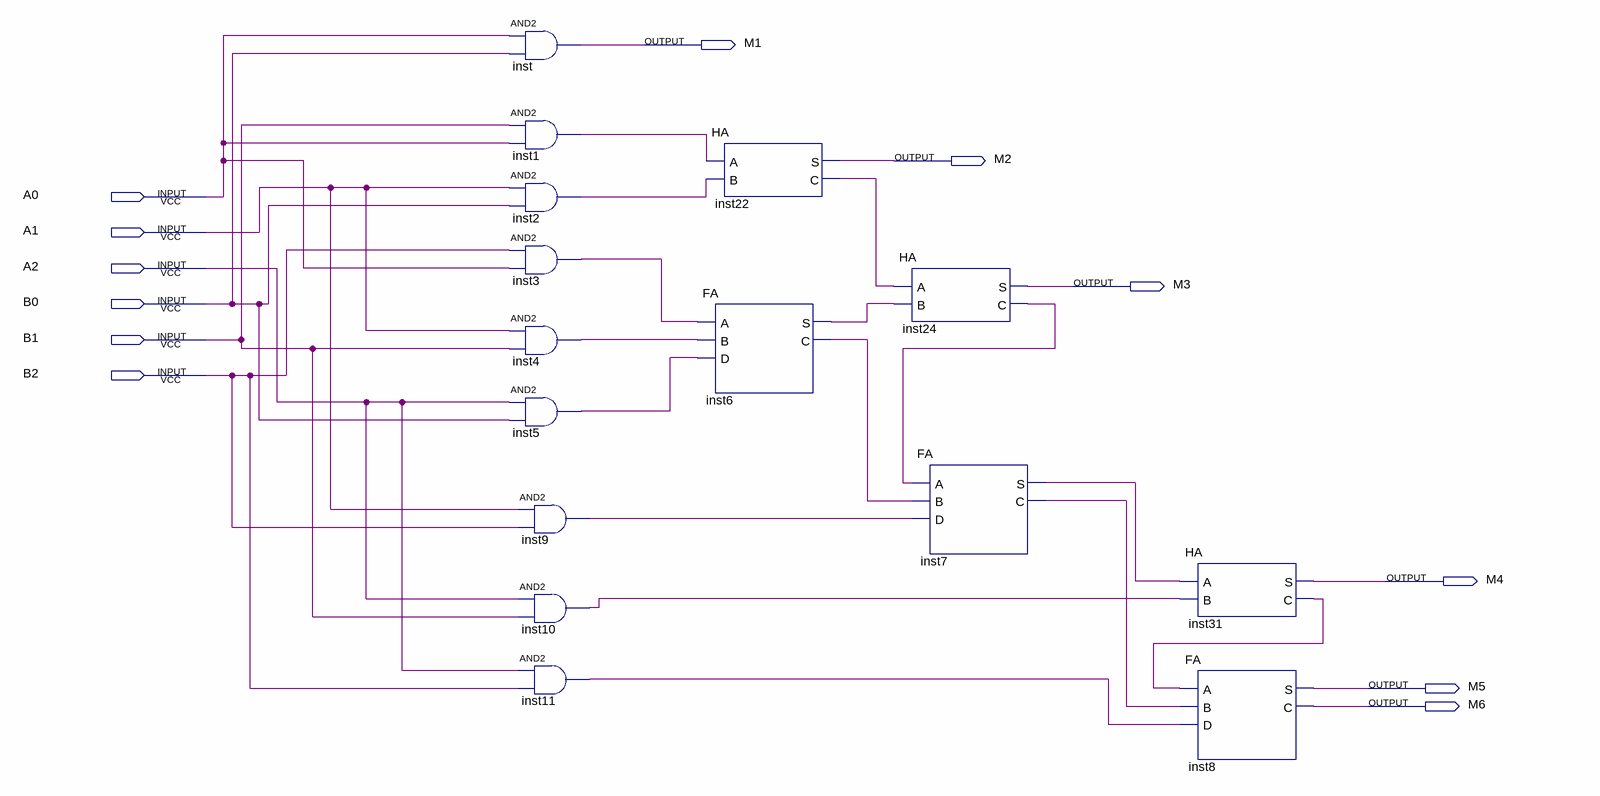
[diagram p0: schematic sheet]
// Quartus schematic Mult.bdf as structural Verilog: 15 symbols, 12 pins
module Mult (
  input  A0,
  input  A1,
  input  A2,
  input  B0,
  input  B1,
  input  B2,
  output M1,
  output M2,
  output M3,
  output M4,
  output M5,
  output M6
);

  wire inst1_out, inst2_out, inst3_out, inst4_out, inst5_out, inst6_c, inst6_s, inst7_c, inst7_s, inst9_out,
       inst10_out, inst11_out, inst22_c, inst24_c, inst31_c;

  and inst (M1, A0, B0);
  and inst1 (inst1_out, B1, A0);
  and inst2 (inst2_out, A1, B0);
  and inst3 (inst3_out, B2, A0);
  and inst4 (inst4_out, A1, B1);
  and inst5 (inst5_out, A2, B0);
  and inst9 (inst9_out, A1, B2);
  and inst10 (inst10_out, A2, B1);
  and inst11 (inst11_out, A2, B2);
  HA inst22 (.A(inst1_out), .B(inst2_out), .S(M2), .C(inst22_c));
  FA inst6 (.A(inst3_out), .B(inst4_out), .D(inst5_out), .S(inst6_s), .C(inst6_c));
  HA inst24 (.A(inst22_c), .B(inst6_s), .S(M3), .C(inst24_c));
  FA inst7 (.A(inst24_c), .B(inst6_c), .D(inst9_out), .S(inst7_s), .C(inst7_c));
  HA inst31 (.A(inst7_s), .B(inst10_out), .S(M4), .C(inst31_c));
  FA inst8 (.A(inst31_c), .B(inst7_c), .D(inst11_out), .S(M5), .C(M6));
endmodule
